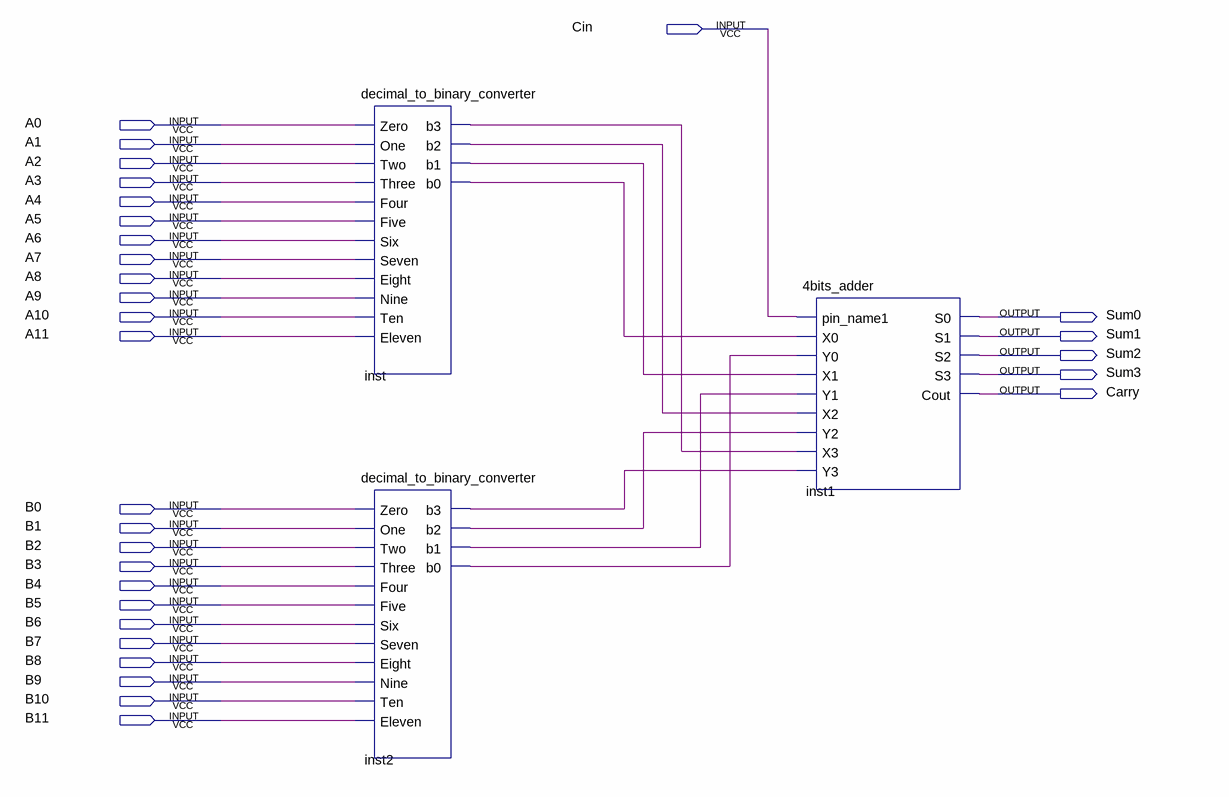
[diagram p0: schematic sheet]
// Quartus schematic 0to11_adder.bdf as structural Verilog: 3 symbols, 30 pins
module \0to11_adder  (
  input  Cin,
  input  A0,
  input  A1,
  input  A2,
  input  A3,
  input  A4,
  input  A5,
  input  A6,
  input  A7,
  input  A8,
  input  A9,
  input  A10,
  input  A11,
  input  B0,
  input  B1,
  input  B2,
  input  B3,
  input  B4,
  input  B5,
  input  B6,
  input  B7,
  input  B8,
  input  B9,
  input  B10,
  input  B11,
  output Sum0,
  output Sum1,
  output Sum2,
  output Sum3,
  output Carry
);

  wire inst2_b0, inst2_b1, inst2_b2, inst2_b3, inst_b0, inst_b1, inst_b2, inst_b3;

  decimal_to_binary_converter inst (
    .Zero(A0), .One(A1), .Two(A2), .Three(A3), .Four(A4), .Five(A5), .Six(A6), .Seven(A7), .Eight(A8),
    .Nine(A9), .Ten(A10), .Eleven(A11), .b3(inst_b3), .b2(inst_b2), .b1(inst_b1), .b0(inst_b0));
  decimal_to_binary_converter inst2 (
    .Zero(B0), .One(B1), .Two(B2), .Three(B3), .Four(B4), .Five(B5), .Six(B6), .Seven(B7), .Eight(B8),
    .Nine(B9), .Ten(B10), .Eleven(B11), .b3(inst2_b3), .b2(inst2_b2), .b1(inst2_b1), .b0(inst2_b0));
  \4bits_adder  inst1 (
    .pin_name1(Cin), .X0(inst_b0), .Y0(inst2_b0), .X1(inst_b1), .Y1(inst2_b1), .X2(inst_b2), .Y2(inst2_b2),
    .X3(inst_b3), .Y3(inst2_b3), .S0(Sum0), .S1(Sum1), .S2(Sum2), .S3(Sum3), .Cout(Carry));
endmodule
